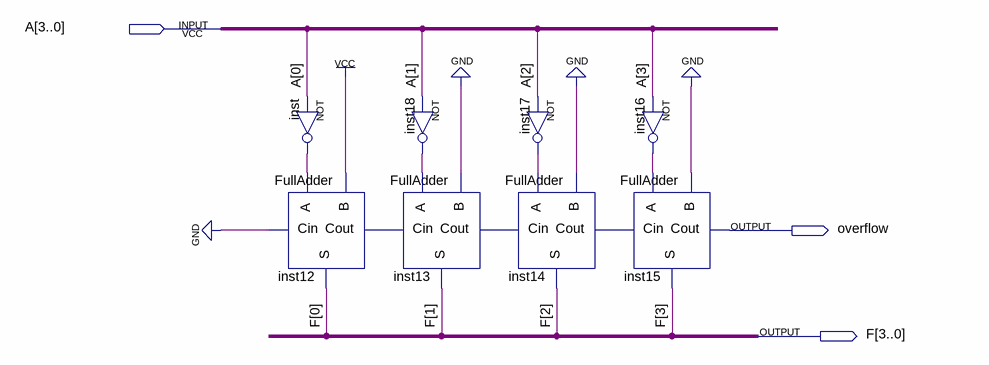
[diagram p0: schematic sheet]
// Quartus schematic Complemento2.bdf as structural Verilog: 8 symbols, 3 pins
module Complemento2 (
  input  [3:0] A,
  output overflow,
  output [3:0] F
);

  wire inst12_cout, inst13_cout, inst14_cout, inst16_out, inst17_out, inst18_out, inst_out;

  not inst (inst_out, A[0]);
  FullAdder inst12 (.A(inst_out), .B(1'b1), .Cin(1'b0), .S(F[0]), .Cout(inst12_cout));
  not inst18 (inst18_out, A[1]);
  FullAdder inst13 (.A(inst18_out), .B(1'b0), .Cin(inst12_cout), .S(F[1]), .Cout(inst13_cout));
  not inst17 (inst17_out, A[2]);
  FullAdder inst14 (.A(inst17_out), .B(1'b0), .Cin(inst13_cout), .S(F[2]), .Cout(inst14_cout));
  not inst16 (inst16_out, A[3]);
  FullAdder inst15 (.A(inst16_out), .B(1'b0), .Cin(inst14_cout), .S(F[3]), .Cout(overflow));
endmodule
